# Altium schematic sheet prec_5V_LDO.SchDoc
size A4; Organization: Altium Limited; Address1: L3, 12a Rodborough Rd; Address2: Frenchs Forest; Address3: NSW; Address4: Australia 2086; DocumentNumber: 10; SheetNumber: 10; SheetTotal: 19
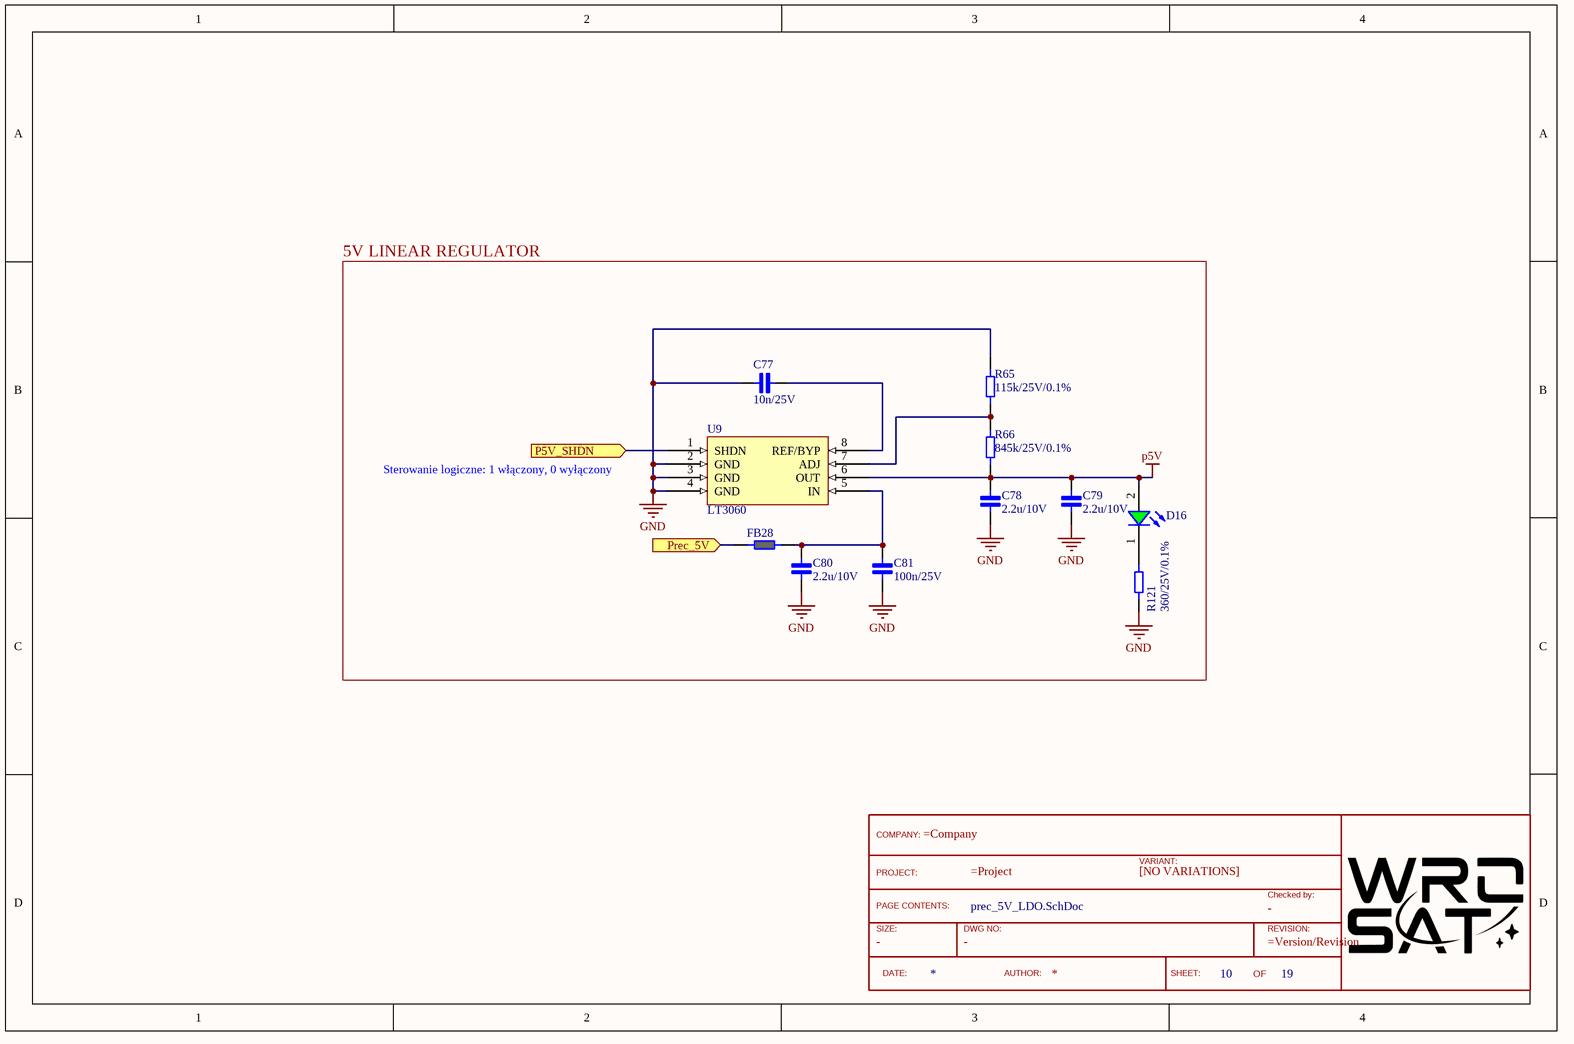
[diagram p0: prec_5V_LDO.SchDoc]

## Parts
?  TitleBlock  (value not drawn)  (graphical)
C77  10n/25V  [Cap_0402]
C78  2.2u/10V  [Cap_0402]
C79  2.2u/10V  [Cap_0402]
C80  2.2u/10V  [Cap_0402]
C81  100n/25V  [Cap_0402]
D16  Green, 3.2V  [WL-SMCW_0603_H=0.7mm]  (value not drawn)
FB28  Ferrite_bead_0402  [FERRITE_0402]  (value not drawn)
R65  115k/25V/0.1%  [RES_0402]
R66  845k/25V/0.1%  [RES_0402]
R121  360/25V/0.1%  [RES_0402]
U9  LT3060  [TS8]

## Blocks framed on the sheet
5V LINEAR REGULATOR: C77-C81 D16 FB28 R65 R66 R121 U9

## Ports
P5V_SHDN (in), Prec_5V (in)

## Nets
GND: C77.2 C78.1 C79.1 C80.1 C81.1 R65.2 R121.1 U9.2(GND) U9.3(GND) U9.4(GND)
p5V: C78.2 C79.2 D16.2(A) R66.1 U9.6(OUT)
P5V_SHDN: U9.1(SHDN) ; port P5V_SHDN
Prec_5V: FB28.1 ; port Prec_5V
NetC77_1: C77.1 U9.8(REF/BYP)
NetC80_2: C80.2 C81.2 FB28.2 U9.5(IN)
NetD16_1: D16.1(K) R121.2
NetR65_1: R65.1 R66.2 U9.7(ADJ)

## Notes on the sheet
- Sterowanie logiczne: 1 włączony, 0 wyłączony
- Title
- Size:
- Date:
- A3
- Number:
- Time:
- Revision:
- Sheet
- of
- File:
- (in symbol TitleBlock) COMPANY:; VARIANT:; PROJECT:; [NO VARIATIONS]; Checked by:; PAGE CONTENTS:; SIZE:; DWG NO:; REVISION:; DATE:; AUTHOR:; SHEET:; OF

## Library data of the parts
? = TitleBlock: Standard TitleBlock; DrawingNo: -; Size: -; Checked: -
C77 = Cap_0402_10n: Ceramic Capacitor 10n / 0402 / 25V / ±5%, Wurth Elektronik MLCC; ComponentLink1Description: New link; ComponentLink1URL: https://www.we-online.com/catalog/en/WCAP-CSGP-25VDC
C78-C80 = Cap_0402_2.2u: Ceramic Capacitor 2.2uF / 0402 / 10V / ±5%, Wurth Elektronik MLCC
C81 = Cap_0402_100n: Ceramic Capacitor 100n / 0402 / 25V / ±5%, Wurth Elektronik MLCC; ComponentLink1Description: New link; ComponentLink1URL: https://www.we-online.com/catalog/en/WCAP-CSGP-25VDC
D16 = 150060GS75000: WL-SMCW SMT Mono-color Chip LED Waterclear, size 0603, Green, 3.2V, 140deg; Chip Technology: InGaN; Dominant Wavelength typ.: 525nm; Luminous Intensity typ.: 430mcd; Peak Wavelength typ.: 515nm; Viewing Angle: 140deg; ComponentLink1Description: Manufacturer; ComponentLink1URL: http://www.we-online.de; ComponentLink2URL: https://www.we-online.com/catalog/datasheet/150060GS75000.pdf; ComponentLink2Description: Datasheet; Forward Voltage typ.: 3.2V; Emitting Color: Green; Mounting Technology: SMT; Operating Temperature: -40 to +85degC; Published Date: December 2019; Part Number: 150060GS75000; Packaging: Tape and Reel; Size: 0603; Publisher: Wurth Elektronik
FB28 = Ferrite_bead_0402: Ferrite bead, wurth 74269241102
R65 = Res_0402_115k: Vishay, thin film resistor 115k/25V/0.1%
R66 = Res_0402_845k: Vishay, thin film resistor 845k/25V/0.1%
R121 = Res_0402_1: Vishay, thin film resistor 1/25V/0.1%
U9 = Lt3060: 45V VIN, Micropower, / Low Noise, 100mA Low / Dropout, Linear Regulator